# EAGLE schematic Eagle_schem_Nepixel_MIC_1_ESP8266_12 (EAGLE 6.3)
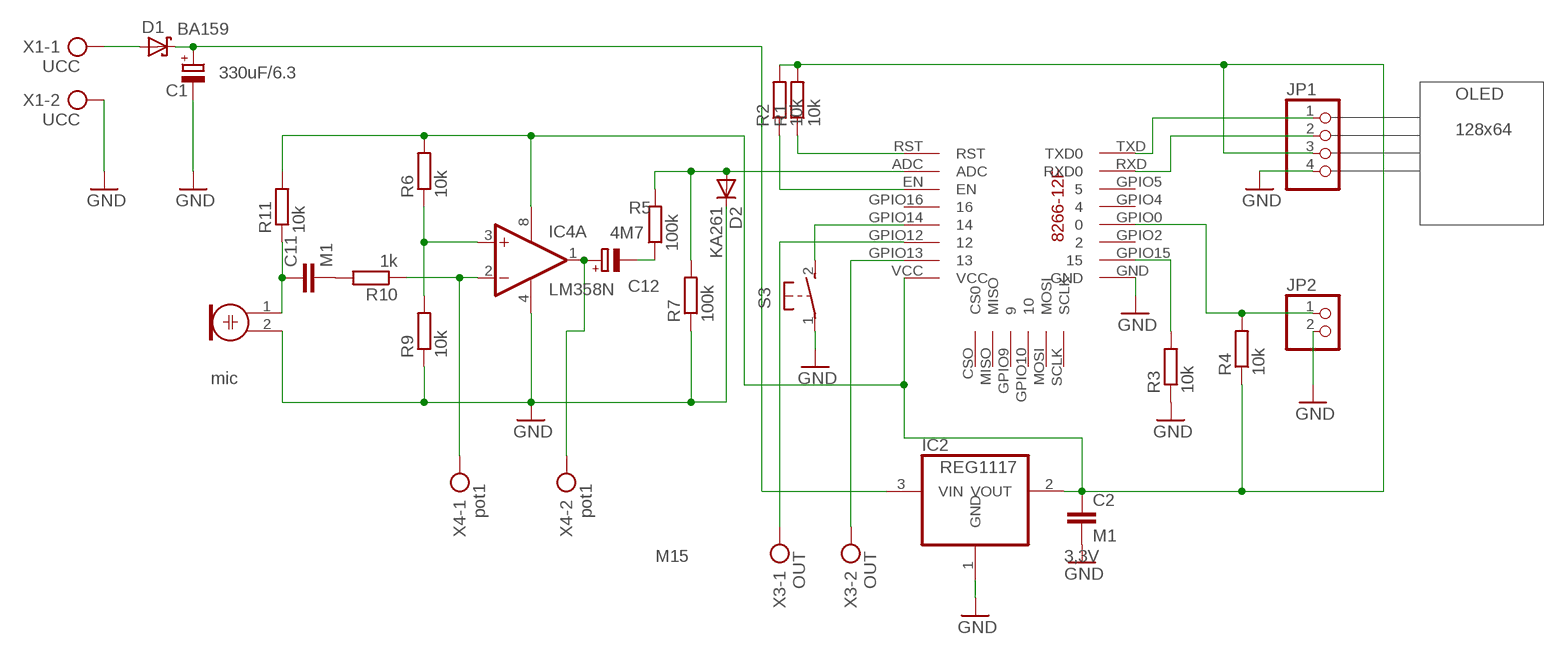
[diagram p0: schematic, sheet 1]

## Parts
C1  330uF/6.3  CPOL-EUE2.5-7  [E2,5-7]
C2  M1  C-EU025-024X044  [C025-024X044]
C11  M1  C-EU025-024X044  [C025-024X044]
C12  4M7  CPOL-EUE2.5-5  [E2,5-5]
D1  BA159  SCHOTTKY-DIODEDO35-7  [DO35-7]
D2  KA261  DIODE-DO41-7.6  [DO41-7.6]
IC2  REG1117  [SOT223]
IC4  LM358N  [DIL08]
JP1  PINHD-1X4  [1X04]
JP2  PINHD-1X2  [1X02]
M1  mic  ELECTRET_MICROPHON-WM.64PN  [WM-64PN]
R1  10k  R-EU_0204/7  [0204/7]
R2  10k  R-EU_0204/7  [0204/7]
R3  10k  R-EU_0204/7  [0204/7]
R4  10k  R-EU_0204/7  [0204/7]
R5  100k  R-EU_0204/7  [0204/7]
R6  10k  R-EU_0204/7  [0204/7]
R7  100k  R-EU_0204/7  [0204/7]
R9  10k  R-EU_0204/7  [0204/7]
R10  1k  R-EU_0204/7  [0204/7]
R11  10k  R-EU_0204/7  [0204/7]
S3  31-XX  [B3F-31XX]
U$1  ESP826612F  [ESP826612F]
X1  UCC  AK550/2  [AK550/2]
X3  OUT  AK550/2  [AK550/2]
X4  pot1  AK550/2  [AK550/2]

## Nets
GND: C1.- C2.2 D2.C IC2.1(GND) IC4.4(P:V-) JP1.4 JP2.2 M1.2 R3.1 R7.1 R9.1 S3.1(P) U$1.GND X1.2
N$1: D1.A X1.1
N$2: S3.2(S) U$1.GPIO14
N$4: JP1.1 U$1.TXD(TXD0)
N$5: JP1.2 U$1.RXD(RXD0)
N$7: JP2.1 R4.2 U$1.GPIO0
N$8: U$1.GPIO13 X3.2
N$9: R1.1 U$1.RST
N$10: U$1.GPIO12 X3.1
N$11: R2.1 U$1.EN
N$12: R3.2 U$1.GPIO15
N$15: C12.- R5.1
N$21: C1.+ D1.C IC2.3(VIN)
N$25: C2.1 IC2.2(VOUT) IC4.8(P:V+) JP1.3 R1.2 R2.2 R4.1 R6.2 R11.2 U$1.VCC
N$61: IC4.2(A:-IN) R10.1 X4.1
N$62: IC4.3(A:+IN) R6.1 R9.2
N$63: C11.2 R10.2
N$64: C11.1 M1.1 R11.1
N$65: D2.A R5.2 R7.2 U$1.ADC
N$66: C12.+ IC4.1(A:OUT) X4.2
Unconnected: IC4.5(B:+IN) IC4.6(B:-IN) IC4.7(B:OUT) U$1.CSO(CS0) U$1.GPIO2 U$1.GPIO4 U$1.GPIO5 U$1.GPIO9 U$1.GPIO10 U$1.GPIO16 U$1.MISO U$1.MOSI U$1.SCLK

## Notes on the sheet
- OLED
- 128x64
- mic
- M15 | 3,3V

## Library data of the parts
C1 C12 = resistor:CPOL-EU: POLARIZED CAPACITOR, European symbol
C2 C11 = resistor:C-EU: CAPACITOR, European symbol
D1 = diode:SCHOTTKY-DIODE: Schottky Diode
D2 = diode:DIODE-: DIODE
IC2 = burr-brown:REG1117: 800mA and 1A Low Dropout (LDO) Positive Regulator 1.8V, 2.5V, 2.85V, 3.3V, 5V, and Adj; MPN: REG1117; OC_FARNELL: 1097566; OC_NEWARK: 14P6981
IC4 = linear:LM358: OP AMP also LM158; LM258; LM2904 Source: http://cache.national.com/ds/LM/LM158.pdf
JP1 = pinhead:PINHD-1X4: PIN HEADER
JP2 = pinhead:PINHD-1X2: PIN HEADER
M1 = microphon:ELECTRET_MICROPHON-: Electret Condenser Microphone
R1-R7 R9-R11 = resistor:R-EU_: RESISTOR, European symbol
S3 = switch-omron:31-XX: OMRON SWITCH; MPN: B3F-3100; OC_FARNELL: 959704; OC_NEWARK: 36M3582
U$1 = ESP8266:ESP826612F
X1 X3 X4 = con-ptr500:AK550/2: CONNECTOR; OC_FARNELL: unknown; OC_NEWARK: unknown